# EAGLE schematic GF_RemoteDoorOpener_RX (EAGLE 7.5.0)
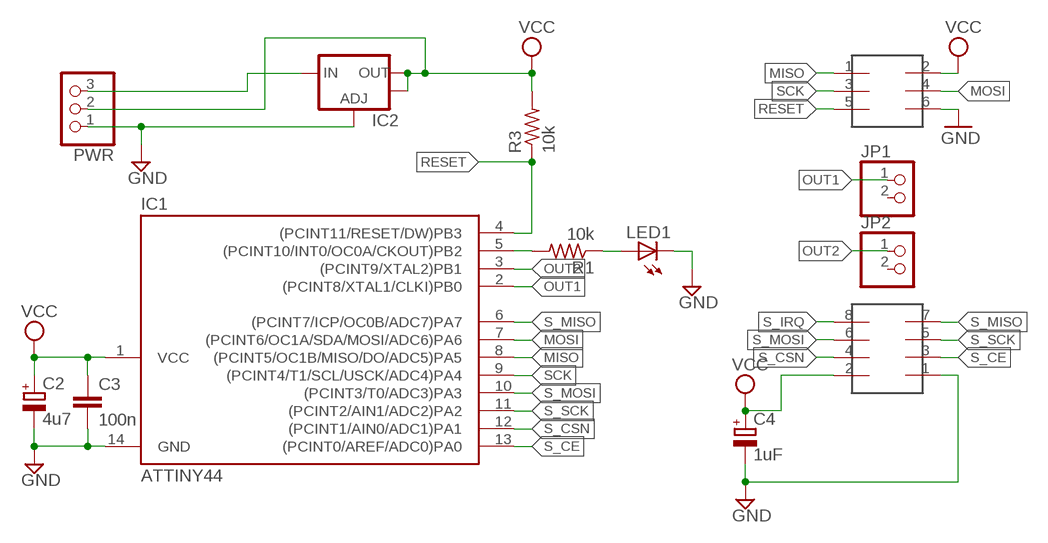
[diagram p0: schematic, sheet 1]

## Parts
C2  4u7  CPOL-EUSMCA  [SMC_A]
C3  100n  C-EUC0603  [C0603]
C4  1uF  CPOL-EUSMCA  [SMC_A]
IC1  ATTINY44  ATTINY24/44/84-SSU  [SOIC14]
IC2  V_REG_LM1117SOT223  [SOT223]
ISP  2X3HEADER  [2X3_SMD]
JP1  PINHD-1X2  [1X02]
JP2  PINHD-1X2  [1X02]
LED1  LEDCHIPLED_1206  [CHIPLED_1206]
PWR  PINHD-1X3  [1X03]
R1  10k  R-US_R0603  [R0603]
R3  10k  R-US_R0603  [R0603]
U$2  2X4HEADER  [2X4_SMD]

## Nets
GND: C2.- C3.2 C4.- IC1.14(GND) IC2.1(ADJ) ISP.6 LED1.C PWR.1 U$2.1
MISO: IC1.8((PCINT5/OC1B/MISO/DO/ADC5)PA5) ISP.1
MOSI: IC1.7((PCINT6/OC1A/SDA/MOSI/ADC6)PA6) ISP.4
N$1: IC1.5((PCINT10/INT0/OC0A/CKOUT)PB2) R1.2
N$2: IC2.3(IN) PWR.3
N$3: LED1.A R1.1
OUT1: IC1.2((PCINT8/XTAL1/CLKI)PB0) JP1.1
OUT2: IC1.3((PCINT9/XTAL2)PB1) JP2.1
RESET: IC1.4((PCINT11/RESET/DW)PB3) ISP.5 R3.1
S_CE: IC1.13((PCINT0/AREF/ADC0)PA0) U$2.3
S_CSN: IC1.12((PCINT1/AIN0/ADC1)PA1) U$2.4
S_IRQ: U$2.8
S_MISO: IC1.6((PCINT7/ICP/OC0B/ADC7)PA7) U$2.7
S_MOSI: IC1.10((PCINT3/T0/ADC3)PA3) U$2.6
S_SCK: IC1.11((PCINT2/AIN1/ADC2)PA2) U$2.5
SCK: IC1.9((PCINT4/T1/SCL/USCK/ADC4)PA4) ISP.3
VCC: C2.+ C3.1 C4.+ IC1.1(VCC) IC2.2(OUT) IC2.4(OUT) ISP.2 PWR.2 R3.2 U$2.2
Unconnected: JP1.2 JP2.2

## Library data of the parts
C2 C4 = rcl:CPOL-EU: POLARIZED CAPACITOR, European symbol
C3 = rcl:C-EU: CAPACITOR, European symbol
IC1 = attiny24_44_84:ATTINY24/44/84
IC2 = SparkFun-PowerIC:V_REG_LM1117: Voltage Regulator LM1117 Standard adjustable voltage regulator but in SMD form. Spark Fun Electronics SKU : COM-00595
ISP = mellis:2X3HEADER
JP1 JP2 = pinhead:PINHD-1X2: PIN HEADER
LED1 = led:LED: LED OSRAM: - CHIPLED LG R971, LG N971, LY N971, LG Q971, LY Q971, LO R971, LY R971 LH N974, LH R974 LS Q976, LO Q976, LY Q976 LO Q996 - Hyper CHIPLED LW Q18S LB Q993, LB Q99A, LB R99A - SideLED LS A670, LO A670, LY A670, LG A670, LP A670 LB A673, LV A673, LT A673, LW A673 LH A674 LY A675 LS A676, LA A676, LO A676, LY A676, LW A676 LS A679, LY A679, LG A679 - Hyper Micro SIDELED® LS Y876, LA Y876, LO Y876, LY Y876 LT Y87S - SmartLED LW L88C, LW L88S LB L89C, LB L89S, LG L890 LS L89K, LO L89K, LY L89K LS L896, LA L896, LO L896, LY L896 - TOPLED LS T670, LO T670, LY T670, LG T670, LP T670 LSG T670, LSP T670, LSY T670, LOP T670, LYG T670 LG T671, LOG T671, LSG T671 LB T673, LV T673, LT T673, LW T673 LH T674 LS T676, LA T676, LO T676, LY T676, LB T676, LH T676, LSB T676, LW T676 LB T67C, LV T67C, LT T67C, LS T67K, LO T67K, LY T67K, LW E67C LS E67B, LA E67B, LO E67B, LY E67B, LB E67C, LV E67C, LT E67C LW T67C LS T679, LY T679, LG T679 LS T770, LO T770, LY T770, LG T770, LP T770 LB T773, LV T773, LT T773, LW T773 LH T774 LS E675, LA E675, LY E675, LS T675 LS T776, LA T776, LO T776, LY T776, LB T776 LHGB T686 LT T68C, LB T68C - Hyper Mini TOPLED® LB M676 - Mini TOPLED Santana® LG M470 LS M47K, LO M47K, LY M47K Source: http://www.osram.convergy.de LUXEON: - LUMILED® LXK2-PW12-R00, LXK2-PW12-S00, LXK2-PW14-U00, LXK2-PW14-V00 LXK2-PM12-R00, LXK2-PM12-S00, LXK2-PM14-U00 LXK2-PE12-Q00, LXK2-PE12-R00, LXK2-PE12-S00, LXK2-PE14-T00, LXK2-PE14-U00 LXK2-PB12-K00, LXK2-PB12-L00, LXK2-PB12-M00, LXK2-PB14-N00, LXK2-PB14-P00, LXK2-PB14-Q00 LXK2-PR12-L00, LXK2-PR12-M00, LXK2-PR14-Q00, LXK2-PR14-R00 LXK2-PD12-Q00, LXK2-PD12-R00, LXK2-PD12-S00 LXK2-PH12-R00, LXK2-PH12-S00 LXK2-PL12-P00, LXK2-PL12-Q00, LXK2-PL12-R00 Source: www.luxeon.com KINGBRIGHT: KA-3528ASYC Source: www.kingbright.com
PWR = pinhead:PINHD-1X3: PIN HEADER
R1 R3 = rcl:R-US_: RESISTOR, American symbol
U$2 = mellis:2X4HEADER